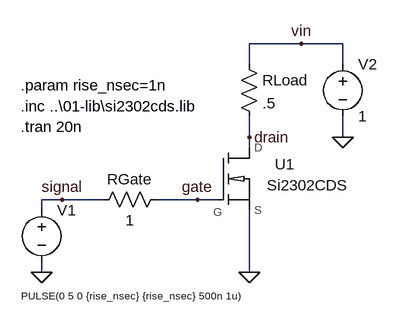
[diagram p0: schematic 02-si2302cds_fast_switching.asc]
02-si2302cds_fast_switching.asc, the LTspice schematic file:
Version 4
SHEET 1 880 680
WIRE 336 -64 256 -64
WIRE 400 -64 336 -64
WIRE 256 -32 256 -64
WIRE 400 -32 400 -64
WIRE 256 80 256 48
WIRE 400 80 400 48
WIRE 256 96 256 80
WIRE -32 176 -64 176
WIRE 32 176 -32 176
WIRE 176 176 112 176
WIRE 208 176 176 176
WIRE -64 192 -64 176
WIRE -64 288 -64 272
WIRE 256 288 256 192
FLAG 256 288 0
FLAG -64 288 0
FLAG 400 80 0
FLAG 336 -64 vin
FLAG 256 80 drain
FLAG 176 176 gate
FLAG -32 176 signal
SYMBOL res 128 160 R90
WINDOW 0 0 56 VBottom 2
WINDOW 3 32 56 VTop 2
SYMATTR InstName RGate
SYMATTR Value 1
SYMBOL voltage -64 176 R0
WINDOW 3 -31 148 Left 1
WINDOW 123 0 0 Left 0
WINDOW 39 0 0 Left 0
SYMATTR InstName V1
SYMATTR Value PULSE(0 5 0 {rise_nsec} {rise_nsec} 500n 1u)
SYMBOL res 240 -48 R0
SYMATTR InstName RLoad
SYMATTR Value .5
SYMBOL voltage 400 -48 R0
WINDOW 123 0 0 Left 0
WINDOW 39 0 0 Left 0
SYMATTR InstName V2
SYMATTR Value 1
SYMBOL Si2302CDS 208 96 R0
SYMATTR InstName U1
TEXT -96 64 Left 2 !.tran 20n
TEXT -96 32 Left 2 !.inc ..\\01-lib\\si2302cds.lib
TEXT -96 0 Left 2 !.param rise_nsec=1n

The netlist it stands for:
* 02-si2302cds_fast_switching.asc
RGate gate signal 1
V1 signal 0 PULSE(0 5 0 {rise_nsec} {rise_nsec} 500n 1u)
RLoad vin drain .5
V2 vin 0 1
XU1 drain gate 0 Si2302CDS  ; pins D G S
.tran 20n
.inc ..\01-lib\si2302cds.lib
.param rise_nsec=1n
.lib si2302cds.lib
.backanno
.end

* Results of the author's LTspice run, read from the files saved beside the schematic
* Operating Point, zero values left out:
*   V(vin) = 1 V
*   V(drain) = 1 V
*   I(Rload) = 31.34 nA
*   I(V2) = -31.34 nA
*   Ix(u1:D) = 31.34 nA
*   Ix(u1:S) = -31.34 nA
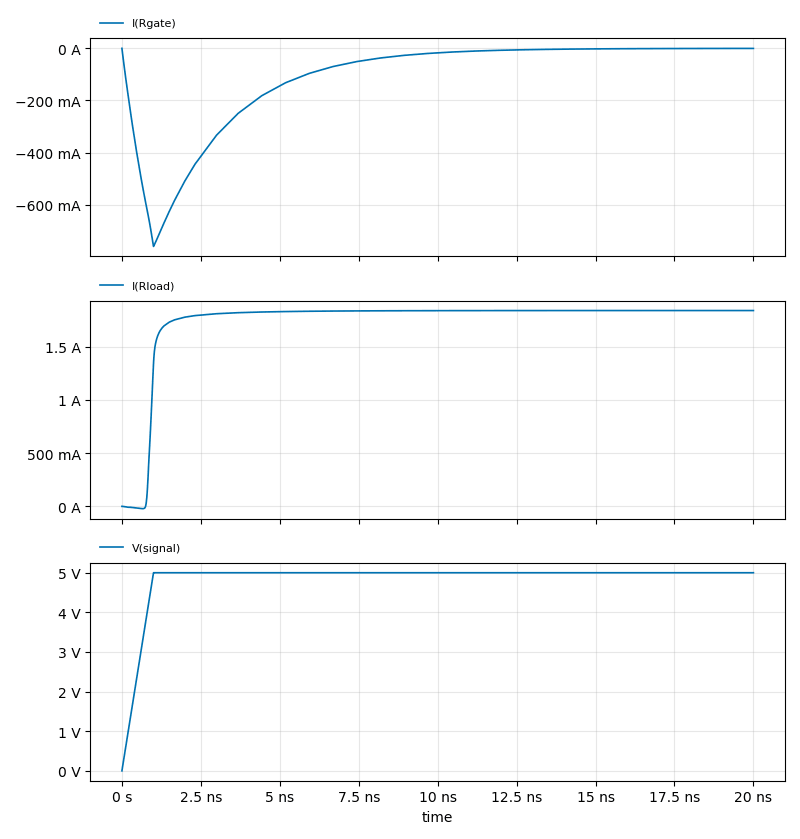
[diagram p1: Transient Analysis of 02-si2302cds_fast_switching.asc, plotted from the saved traces]
* Transient Analysis, 1 run:
*   I(Rgate): min -760.5 mA, max 0 A, average -112.2 mA, rms 215.1 mA, last -246.9 µA
*   I(Rload): min -21.17 mA, max 1.839 A, average 1.742 A, rms 1.782 A, last 1.839 A
*   V(signal): min 0 V, max 5 V, average 4.875 V, rms 4.916 V, last 5 V